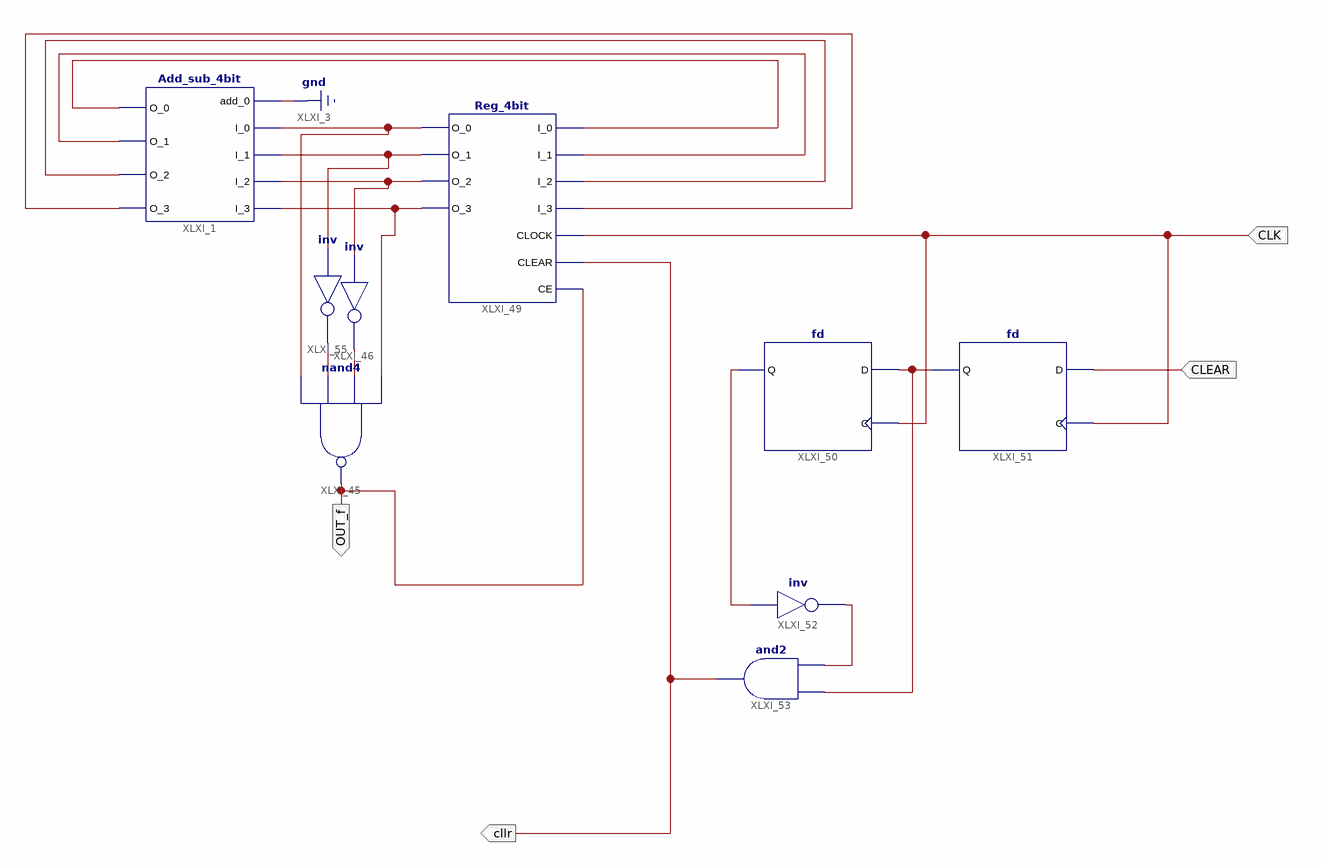
[diagram p0: schematic sheet 1]
// Xilinx ISE schematic decade_counter_new.sch (spartan3e) as structural Verilog: 9 symbols, 4 ports
module decade_counter_new (
  input  CLK,
  input  CLEAR,
  output OUT_f,
  output cllr
);

  wire XLXN_48, XLXN_49, XLXN_78, XLXN_109, XLXN_110, XLXN_111, XLXN_113, XLXN_114, XLXN_122, XLXN_125,
       XLXN_126, XLXN_208, XLXN_209;

  nand XLXI_45 (OUT_f, XLXN_109, XLXN_208, XLXN_209, XLXN_78);
  Add_sub_4bit XLXI_1 (
    .I_3(XLXN_78), .I_2(XLXN_49), .I_1(XLXN_48), .I_0(XLXN_109), .add_0(1'b0), .O_3(XLXN_114),
    .O_2(XLXN_111), .O_1(XLXN_110), .O_0(XLXN_113));
  Reg_4bit XLXI_49 (
    .I_1(XLXN_110), .I_0(XLXN_113), .I_2(XLXN_111), .I_3(XLXN_114), .CLOCK(CLK), .CLEAR(cllr), .O_3(XLXN_78),
    .O_2(XLXN_49), .O_1(XLXN_48), .O_0(XLXN_109), .CE(OUT_f));
  and XLXI_53 (cllr, XLXN_122, XLXN_125);
  not XLXI_52 (XLXN_125, XLXN_126);
  fd XLXI_51 (.C(CLK), .D(CLEAR), .Q(XLXN_122));
  fd XLXI_50 (.C(CLK), .D(XLXN_122), .Q(XLXN_126));
  not XLXI_55 (XLXN_208, XLXN_48);
  not XLXI_46 (XLXN_209, XLXN_49);
endmodule
